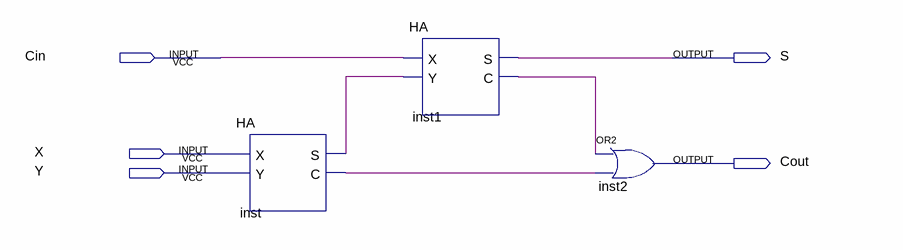
[diagram p0: schematic sheet]
// Quartus schematic FA.bdf as structural Verilog: 3 symbols, 5 pins
module FA (
  input  Cin,
  input  X,
  input  Y,
  output S,
  output Cout
);

  wire inst1_c, inst_c, inst_s;

  HA inst (.X(X), .Y(Y), .S(inst_s), .C(inst_c));
  HA inst1 (.X(Cin), .Y(inst_s), .S(S), .C(inst1_c));
  or inst2 (Cout, inst1_c, inst_c);
endmodule
